# Altium schematic sheet EE209_Schematic.SchDoc: Wireless Energy Monitor
size A3; Author: Team XX; Organization: EE/CS 209 Class of 2022; Address1: Department of ECSE; Address2: The University of Auckland; Address3: 20 Symonds Street; Address4: Auckland, NZ; Revision: 1.0; SheetNumber: 1; SheetTotal: 1
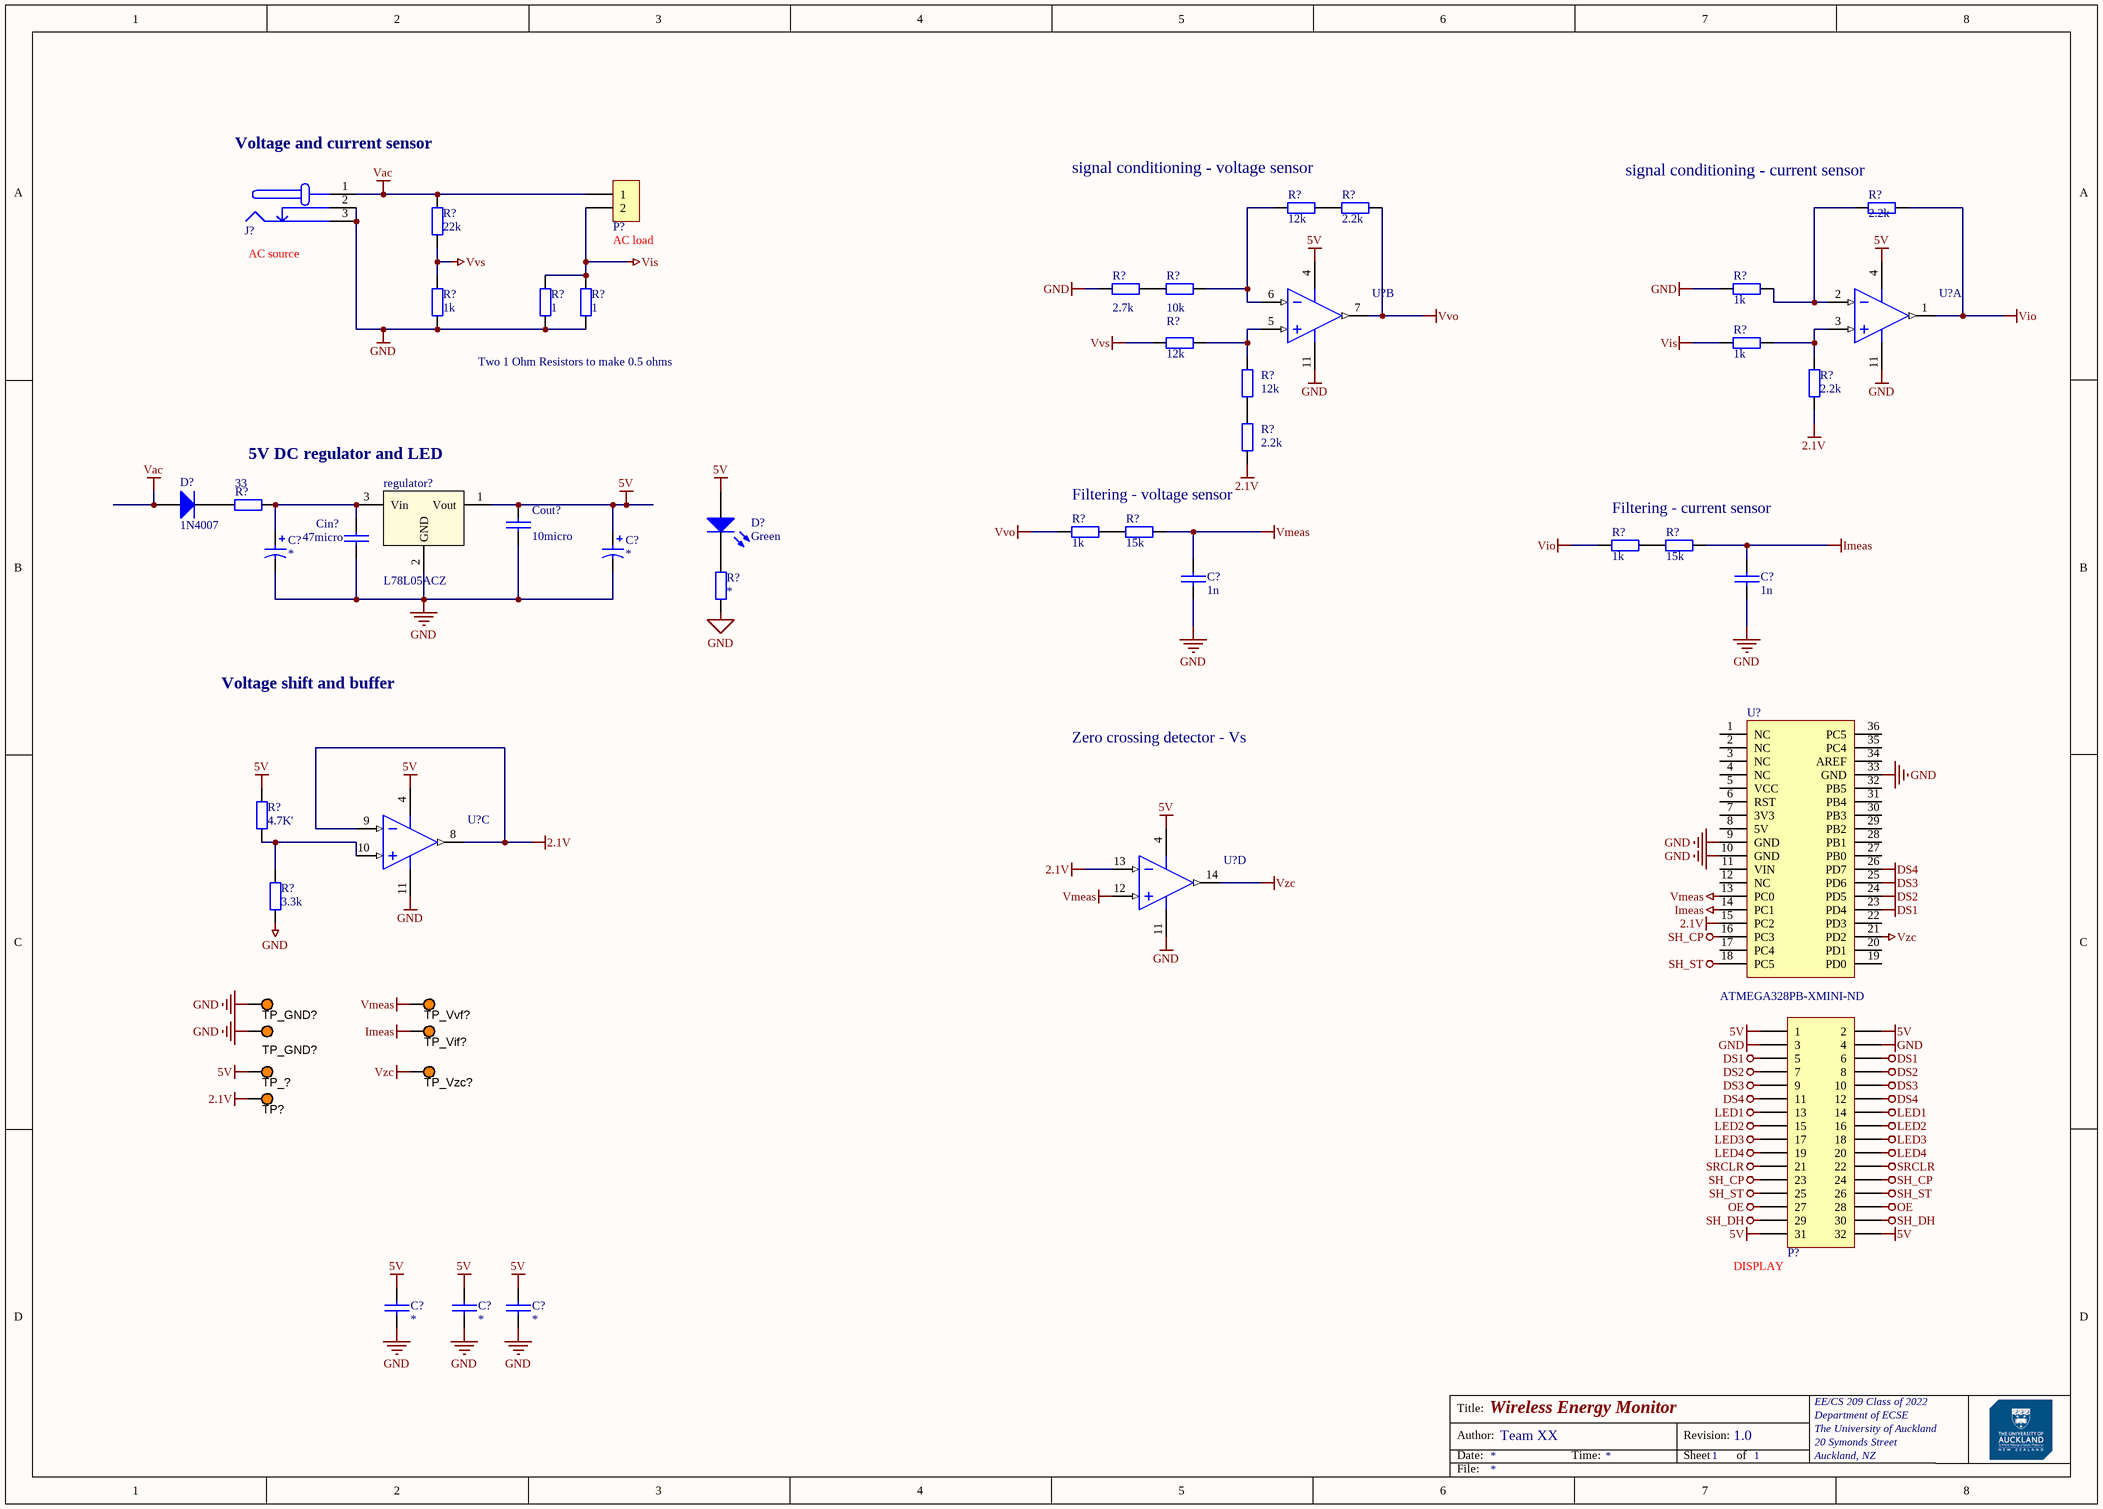
[diagram p0: EE209_Schematic.SchDoc]

## Parts
(Parts that share a designator on the sheet are numbered #1, #2 ... from top to bottom, then left to right.)
C?#1  *  [CAP-RAD-2.5mm Pitch]
C?#2  *  [CAP-RAD-2.5mm Pitch]
C?#3  1n  [CCAP-5P0]
C?#4  1n  [CCAP-5P0]
C?#5  *  [CCAP-5P0]
C?#6  *  [CCAP-5P0]
C?#7  *  [CCAP-5P0]
Cin?  47micro  [CCAP-5P0]
Cout?  10micro  [CCAP-5P0]
D?#1  1N4007  [1N4007-MFG]
D?#2  Green  [LED]
J?  DC barrel jack  [AC-Socket]  (value not drawn)
P?#1  Dual Banana Plugs  [Dual Banana Plug]  (value not drawn)
P?#2  Display  [Display]  (value not drawn)
R?#1  12k  [AXIAL-0.4]
R?#2  2.2k  [AXIAL-0.4]
R?#3  2.2k  [AXIAL-0.4]
R?#4  22k  [AXIAL-0.4]
R?#5  2.7k  [AXIAL-0.4]
R?#6  10k  [AXIAL-0.4]
R?#7  1k  [AXIAL-0.4]
R?#8  1k  [AXIAL-0.4]
R?#9  1  [AXIAL-0.4]
R?#10  1  [AXIAL-0.4]
R?#11  12k  [AXIAL-0.4]
R?#12  1k  [AXIAL-0.4]
R?#13  12k  [AXIAL-0.4]
R?#14  2.2k  [AXIAL-0.4]
R?#15  2.2k  [AXIAL-0.4]
R?#16  33  [AXIAL-0.4]
R?#17  1k  [AXIAL-0.4]
R?#18  15k  [AXIAL-0.4]
R?#19  1k  [AXIAL-0.4]
R?#20  15k  [AXIAL-0.4]
R?#21  *  [AXIAL-0.4]
R?#22  4.7K'  [AXIAL-0.4]
R?#23  3.3k  [AXIAL-0.4]
regulator?  L78L05ACZ  [TO-92]
TP?  5003  [TP_TH]  (value not drawn)
TP_?  5003  [TP_TH]  (value not drawn)
TP_GND?#1  5003  [TP_TH]  (value not drawn)
TP_GND?#2  5003  [TP_TH]  (value not drawn)
TP_Vif?  5003  [TP_TH]  (value not drawn)
TP_Vvf?  5003  [TP_TH]  (value not drawn)
TP_Vzc?  5003  [TP_TH]  (value not drawn)
U?#1  LM324  [DIP-14]  (value not drawn)  (part B of 4)
U?#2  LM324  [DIP-14]  (value not drawn)  (part A of 4)
U?#3  LM324  [DIP-14]  (value not drawn)  (part C of 4)
U?#4  Supplier Part Number 1: ATMEGA328PB-XMINI-ND  [ATmeg328P Xplained]  (hidden comment: ATmega328PB Xplained Mini Header)
U?#5  LM324  [DIP-14]  (value not drawn)  (part D of 4)

## Nets
2.1V: R?#14.1 R?#15.1 TP?.1 U?#3.8(VOUTC) U?#3.9(VINC-) U?#4.15(PC2) U?#5.13(VIND-)
5V: C?#2.1 C?#5.1 C?#6.1 C?#7.1 Cout?.1 D?#2.1(A) P?#2.1 P?#2.2 P?#2.31 P?#2.32 R?#22.2 regulator?.1(Vout) TP_?.1 U?#1.4(VDD) U?#2.4(VDD) U?#3.4(VDD) U?#5.4(VDD)
DS1: P?#2.5 P?#2.6 U?#4.23(PD4)
DS2: P?#2.7 P?#2.8 U?#4.24(PD5)
DS3: P?#2.9 P?#2.10 U?#4.25(PD6)
DS4: P?#2.11 P?#2.12 U?#4.26(PD7)
GND: C?#1.2 C?#2.2 C?#3.2 C?#4.2 C?#5.2 C?#6.2 C?#7.2 Cin?.2 Cout?.2 J?.2(GND_ALT) J?.3(GND) P?#2.3 P?#2.4 R?#5.1 R?#7.1 R?#8.1 R?#9.1 R?#10.1 R?#21.1 R?#23.1 regulator?.2(GND) TP_GND?#1.1 TP_GND?#2.1 U?#1.11(VSS) U?#2.11(VSS) U?#3.11(VSS) U?#4.9(GND) U?#4.10(GND) U?#4.33(GND) U?#5.11(VSS)
Imeas: C?#4.1 R?#20.2 TP_Vif?.1 U?#4.14(PC1)
LED1: P?#2.13 P?#2.14
LED2: P?#2.15 P?#2.16
LED3: P?#2.17 P?#2.18
LED4: P?#2.19 P?#2.20
OE: P?#2.27 P?#2.28
SH_CP: P?#2.23 P?#2.24 U?#4.16(PC3)
SH_DH: P?#2.29 P?#2.30
SH_ST: P?#2.25 P?#2.26 U?#4.18(PC5)
SRCLR: P?#2.21 P?#2.22
Vac: D?#1.1(A) J?.1(VCC) P?#1.1 R?#4.2
Vio: R?#3.2 R?#19.1 U?#2.1(VOUTA)
Vis: P?#1.2 R?#9.2 R?#10.2 R?#12.1
Vmeas: C?#3.1 R?#18.2 TP_Vvf?.1 U?#4.13(PC0) U?#5.12(VIND+)
Vvo: R?#2.2 R?#17.1 U?#1.7(VOUTB)
Vvs: R?#4.1 R?#8.2 R?#11.1
Vzc: TP_Vzc?.1 U?#4.21(PD2) U?#5.14(VOUTD)
NetC?#1_1: C?#1.1 Cin?.1 R?#16.2 regulator?.3(Vin)
NetD?#1_2: D?#1.2(K) R?#16.1
NetD?#2_2: D?#2.2(K) R?#21.2
NetR?#1_1: R?#1.1 R?#6.2 U?#1.6(VINB-)
NetR?#1_2: R?#1.2 R?#2.1
NetR?#3_1: R?#3.1 R?#7.2 U?#2.2(VINA-)
NetR?#5_2: R?#5.2 R?#6.1
NetR?#11_2: R?#11.2 R?#13.2 U?#1.5(VINB+)
NetR?#12_2: R?#12.2 R?#14.2 U?#2.3(VINA+)
NetR?#13_1: R?#13.1 R?#15.2
NetR?#17_2: R?#17.2 R?#18.1
NetR?#19_2: R?#19.2 R?#20.1
NetR?#22_1: R?#22.1 R?#23.2 U?#3.10(VINC+)

Not connected (* = marked no-connect by the designer): U?#4 1(NC) 2(NC) 3(NC) 4(NC) 5(VCC) 6(RST) 7(3V3) 8(5V) 11(VIN) 12(NC) 17(PC4) 19(PD0) 20(PD1) 22(PD3) 27(PB0) 28(PB1) 29(PB2) 30(PB3) 31(PB4) 32(PB5) 34(AREF) 35(PC4) 36(PC5)

## Notes on the sheet
- Voltage and current sensor
- (near R?#1) signal conditioning - voltage sensor
- (near R?#3) signal conditioning - current sensor
- (near P?#1) AC load
- (near J?) AC source
- (near R?#10) Two 1 Ohm Resistors to make 0.5 ohms
- 5V DC regulator and LED
- (near R?#17) Filtering - voltage sensor
- (near R?#19) Filtering - current sensor
- Voltage shift and buffer
- Zero crossing detector - Vs
- (near P?#2) DISPLAY
- Title:
- Author:
- Date:
- Time:
- Revision:
- Sheet
- of
- File:

## Library data of the parts
C?#1 C?#2 = ElecCap_TH_2P0: Electrolytic capacitor with radial package, 2mm pitch and 5.2mm diameter; Published: 8-Jun-2000; LatestRevisionDate: 17-Jul-2002; LatestRevisionNote: Re-released for DXP Platform.; PackageReference: POLAR0.8; Publisher: Altium Limited; PackageDescription: Polarized Capacitor; 2 Leads; Value: *
C?#3-C?#7 Cin? Cout? = CerCap_TH_5P0: TH ceramic capacitor with 5mm pitch
  C?#3-C?#7 Cout?: Value: *
  Cin?: Value: 47micro
D?#1 = 1N4007_TH_4AX0: 1N4007 1000V standard axial diode; ComponentLink1URL: https://www.fairchildsemi.com/datasheets/1N/1N914.pdf; ComponentLink1Description: https://www.fairchildsemi.com/datasheets/1N/1N914.pdf; Supplier 1: Digi-Key; Supplier Part Number 1: 1N4007RLGOSCT-ND
D?#2 = LED_TH_2P54: Typical throughole GaAs LED with 2.54mm pitch; Manufacturer: Generic Components; Class I: Optoelectronic; Published: 8-Jun-2000; Revision: July-2002: Re-released for DXP Platform.; Publisher: Altium Limited; Class II: LED; Value: Green
J? = AC_Input: DC barrel jack connection to AC source; Value: socket
P?#1 = AC_Output: Dual banana plugs connection to the AC load; LatestRevisionDate: 17-Jul-2002; LatestRevisionNote: Re-released for DXP Platform.; Publisher: Altium Limited
P?#2 = Display: 16-Pin Header Connecting Display
R?#1 R?#3 R?#4 R?#13 R?#14 = Res_TH_0AX4: Through hole resistor; Value: 100k; Published: 8-Jun-2000; LatestRevisionDate: 17-Jul-2002; LatestRevisionNote: Re-released for DXP Platform.; PackageReference: AXIAL-0.4; Publisher: Altium Limited; ComponentLink1Description: http://www.royalohm.com/pdf/product2017/PrecisionMetalMF.pdf
R?#2 R?#5 R?#6 R?#9 R?#10 R?#15-R?#23 = Res_TH_0AX4: Through hole resistor; Published: 8-Jun-2000; LatestRevisionDate: 17-Jul-2002; LatestRevisionNote: Re-released for DXP Platform.; PackageReference: AXIAL-0.4; Publisher: Altium Limited; ComponentLink1Description: http://www.royalohm.com/pdf/product2017/PrecisionMetalMF.pdf
  R?#2 R?#5 R?#15-R?#23: Value: *
  R?#6: Value: 10k
  R?#9 R?#10: Value: 1
R?#7 R?#11 R?#12 = Res_TH_0AX4: Through hole resistor; Value: 10k; Published: 8-Jun-2000; LatestRevisionDate: 17-Jul-2002; LatestRevisionNote: Re-released for DXP Platform.; PackageReference: AXIAL-0.4; Publisher: Altium Limited; ComponentLink1Description: http://www.royalohm.com/pdf/product2017/PrecisionMetalMF.pdf
R?#8 = Res_TH_0AX4: Through hole resistor; Value: 1k2; Published: 8-Jun-2000; LatestRevisionDate: 17-Jul-2002; LatestRevisionNote: Re-released for DXP Platform.; PackageReference: AXIAL-0.4; Publisher: Altium Limited; ComponentLink1Description: http://www.royalohm.com/pdf/product2017/PrecisionMetalMF.pdf
regulator? = L78L05_TH_TO92: Voltage Regulator 5V; Manufacturer: ON Semiconductor; Manufacturer Part Number: LM78L05ACZX; Output Configuration: Positive; Output Type: Fixed; Voltage - Input (Max): 30V; Current - Output: 100mA; PSRR: 80dB (120Hz); Protection Features: Over Temperature, Short Circuit; Supplier 1: Digi-Key; RoHS: RoHS Compliant; Category: Integrated Circuits (ICs); Stock 1: 7782; Pricing 1: 1=0.69, 10=0.517, 100=0.3226, 500=0.2207, 1000=0.16976 (NZD); Packaging: Cut Tape (CT); Part Status: Active; Voltage - Output (Min/Fixed): 5V; Voltage - Output (Max): -; Voltage Dropout (Max): -; Control Features: -; Operating Temperature: -40°C ~ 125°C; Mounting Type: Through Hole; Package / Case: TO-226-3, TO-92-3 (TO-226AA) (Formed Leads); Supplier Device Package: TO-92-3; Base Part Number: LM78L05; ComponentLink1URL: https://www.fairchildsemi.com/datasheets/MC/MC78L05A.pdf; ComponentLink1Description: https://www.fairchildsemi.com/datasheets/MC/MC78L05A.pdf; Supplier Part Number 1: LM78L05ACZXCT-ND
TP? TP_? TP_GND?#1 TP_GND?#2 TP_Vif? TP_Vvf? TP_Vzc? = TestPoint: Test Point, Orange, 1-Pin THD, RoHS; Peak Reverse Current: 600 uA; Forward Current: 3 A; Max Surge Current: 80 A; Forward Voltage: 1.08 V; Max Operating Temperature: 150 degC; PackageReference: 5003; Pins: 2; ComponentLink2URL: http://keyelco.com/userAssets/file/M65p56.pdf; PackageDescription: 1-Pin Through Hole Device, Dia 2.54 mm; Weight: 0.01 lb; Diameter: 5.3 mm; Mount: Through Hole; Package Quantity: 500; Packaging: Bulk; Min Operating Temperature: -65 degC; ComponentLink1Description: Manufacturer URL; Height: 0.25 inch; ComponentLink1URL: http://www.keyelco.com/; ComponentLink2Description: Datasheet; Width: 0.25 inch; REACH SVHC: No SVHC; RoHSCompliant: true; Radiation Hardening: No; Length: 9.5 mm; DatasheetVersion: Jun-15
U?#1-U?#3 U?#5 = LM324N_TH_DIP16: IC OPAMP GP 14DIP; Manufacturer: ON Semiconductor; Manufacturer Part Number: LM324N; Amplifier Type: General Purpose; Current - Supply: 1mA; Voltage - Supply, Single/Dual (±): 3 V ~ 32 V, ±1.5 V ~ 16 V; Supplier 1: Digi-Key; RoHS: RoHS Compliant; Category: Integrated Circuits (ICs); Stock 1: 2900; Pricing 1: 1=0.9, 10=0.775, 100=0.5789, 500=0.45482, 1000=0.35145 (NZD); Packaging: Tube; Part Status: Active; Output Type: -; Slew Rate: -; Operating Temperature: 0°C ~ 70°C; Mounting Type: Through Hole; Package / Case: 14-DIP (0.300", 7.62mm); Supplier Device Package: 14-DIP; Base Part Number: LM324; ComponentLink1URL: https://www.fairchildsemi.com/datasheets/LM/LM2902.pdf; ComponentLink1Description: https://www.fairchildsemi.com/datasheets/LM/LM2902.pdf; Supplier Part Number 1: LM324NFS-ND
U?#4 = ATmega328PBXplained_TH: Dual 18-pin headers connecting to ATmega328PB Xplained Mini; Manufacturer: Microchip Technology; Manufacturer Part Number: ATMEGA328PB-XMINI; Board Type: Evaluation Platform; Core Processor: AVR; Platform: ATmega328P Xplained Mini; Contents: Board(s); Supplier 1: Digi-Key; RoHS: RoHS Compliant; Category: Development Boards, Kits, Programmers; Stock 1: 454; Pricing 1: 1=15.11 (NZD); Part Status: Active; Type: MCU 8-Bit; Operating System: -; For Use With/Related Products: ATmega328P; Mounting Type: Fixed; ComponentLink1URL: http://www.microchip.com/mymicrochip/filehandler.aspx?ddocname=en589665; ComponentLink1Description: http://www.microchip.com/mymicrochip/filehandler.aspx?ddocname=en589665